# EAGLE design Durchgangsprüfer11 (EAGLE 8.3.2)
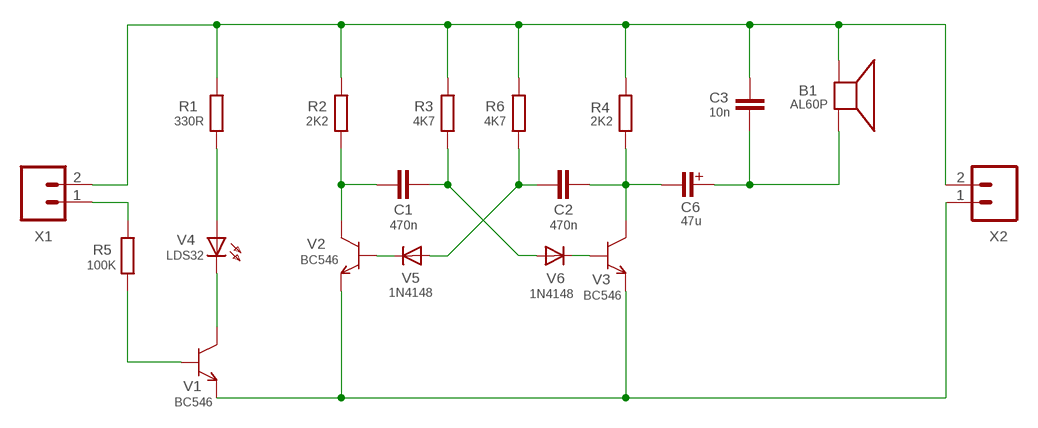
[diagram p0: schematic, sheet 1]

## Parts
B1  AL60P  [AL60P]
C1  470n  C-EUC05-024X044  [C050-024X044]
C2  470n  C-EUC05-024X044  [C050-024X044]
C3  10n  C-EUC05-024X044  [C050-024X044]
C6  47u  CPOL-EUE2.5-6  [E2,5-6]
R1  330R  R-EU_0207/10  [0207/10]
R2  2K2  R-EU_0207/10  [0207/10]
R3  4K7  R-EU_0207/10  [0207/10]
R4  2K2  R-EU_0207/10  [0207/10]
R5  100K  R-EU_0207/10  [0207/10]
R6  4K7  R-EU_0207/10  [0207/10]
V1  BC546  NPN_EBCBC546  [TO92IL]
V2  BC546  NPN_EBCBC546  [TO92IL]
V3  BC546  NPN_EBCBC546  [TO92IL]
V4  LDS32  LED5MM  [LED5]
V5  1N4148  DIODE7_5  [D7_5]
V6  1N4148  DIODE7_5  [D7_5]
X1  M02  [02P]
X2  M02  [02P]

## Nets
+12: B1.1 C3.1 R1.2 R2.2 R3.2 R4.2 R6.2 X1.2 X2.2
GND: V1.E V2.E V3.E X2.1
N$1: C2.1 R6.1 V5.A
N$2: C1.2 R3.1 V6.A
N$3: V2.B V5.C
N$4: C1.1 R2.1 V2.C
N$5: V3.B V6.C
N$6: C2.2 C6.- R4.1 V3.C
N$7: B1.2 C3.2 C6.+
N$10: R1.1 V4.A
N$11: V1.C V4.K(C)
N$12: R5.2 V1.B
N$13: R5.1 X1.1

## Library data of the parts
B1 = buzzer:AL60P: SPEAKER Source: Buerklin
C1-C3 = mylib:C-EU
C6 = mylib:CPOL-EU: POLARIZED CAPACITOR, European symbol
R1-R6 = mylib:R-EU_: RESISTOR, European symbol
V1-V3 = mylib:NPN_EBC
V4 = mylib:LED
V5 V6 = mylib:DIODE
X1 X2 = con-amp-quick:M02: AMP QUICK CONNECTOR

## Board
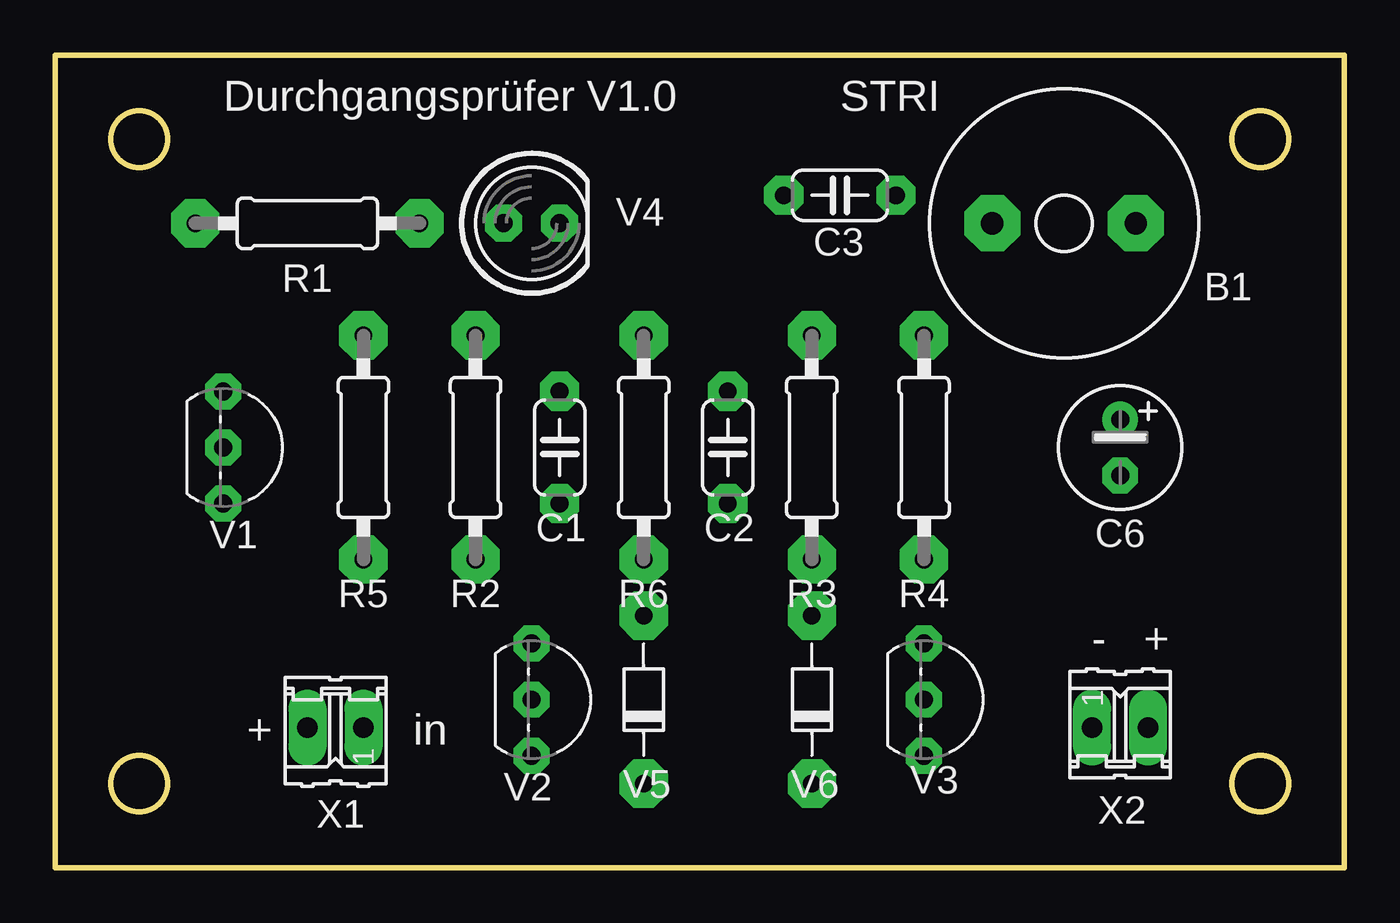
[diagram p1: board, top side]
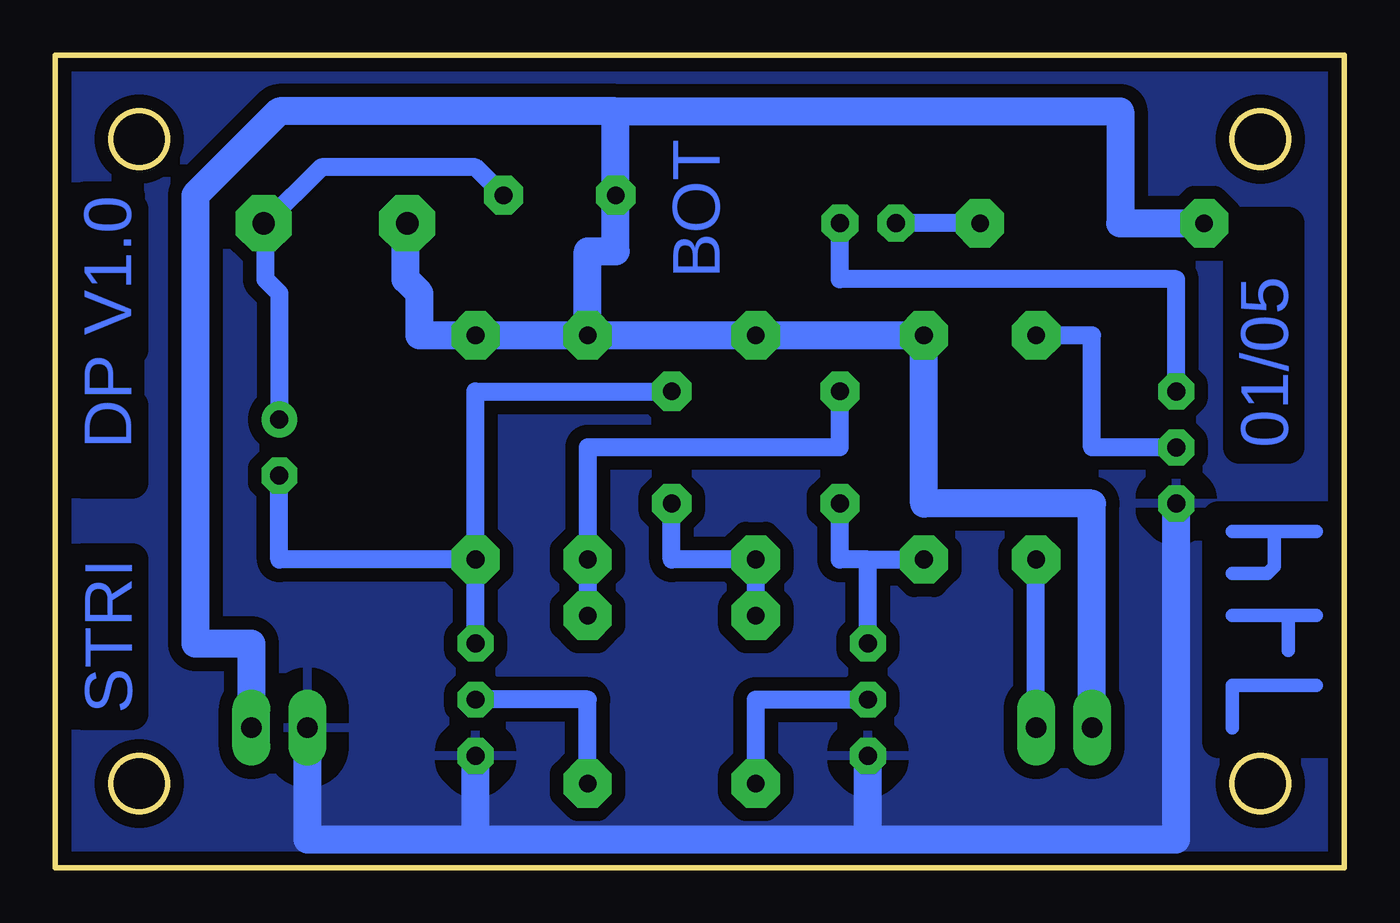
[diagram p2: board, bottom side, seen from below]

Size 58.42 x 36.83 mm. Coordinates in mm from the lower left corner, seen from the top.
Outline: 0,0 58.42,0 58.42,36.83 0,36.83 0,0
Outline: circle at 3.81,33.02 radius 1.27
Outline: circle at 54.61,33.02 radius 1.27
Outline: circle at 54.61,3.81 radius 1.27
Outline: circle at 3.81,3.81 radius 1.27
Copper layers (1+16): Top 0.035mm / dielectric 1.5mm / Bottom 0.035mm
Design rules "2HN": minimum track width 16mil, minimum drill 0.6mm, track to track 10mil, track to pad 8mil, pad to pad 8mil, via to via 8mil, smd to smd 8mil, copper to edge 20mil, drill to drill 8mil, minimum pad ring 16mil, minimum via ring 15mil, stop-mask expansion 4mil, vias tented up to drill 0mil, thermal gap 40mil
bRestrict: 20 lines

### Footprints (pad centres in the part's own frame; a part is rotated, then mirrored left to right if it is on the bottom)
AL60P = drill 1.016 pad 2.54 octagon: 1 -3.251,0; 2 3.251,0
C050-024X044 = drill 0.8 pad 1.778 octagon: 1 -2.54,0; 2 2.54,0
E2,5-6 = drill 0.813 pad 1.6: + -1.27,0 | drill 0.813 pad 1.6 octagon: - 1.27,0
0207/10 = drill 0.8 pad 2.184 octagon: 1 -5.08,0; 2 5.08,0
TO92IL = drill 0.813 octagon: B 0,0; C -2.54,0; E 2.54,0
LED5 = drill 0.813 pad 1.676 octagon: A -1.27,0; K 1.27,0
D7_5 = drill 0.8 pad 2.184 octagon: A 3.81,0; C -3.81,0
02P = drill 0.914 long: 1 -1.27,0; 2 1.27,0

### Placement (x,y rotation side)
B1  45.72,29.21 0 top
C1  22.86,19.05 90 top
C2  30.48,19.05 90 top
C3  35.56,30.48 0 top
C6  48.26,19.05 270 top
R1  11.43,29.21 180 top
R2  19.05,19.05 90 top
R3  34.29,19.05 90 top
R4  39.37,19.05 90 top
R5  13.97,19.05 90 top
R6  26.67,19.05 90 top
V1  7.62,19.05 270 top
V2  21.59,7.62 270 top
V3  39.37,7.62 270 top
V4  21.59,29.21 0 top
V5  26.67,7.62 90 top
V6  34.29,7.62 90 top
X1  12.7,6.35 180 top
X2  48.26,6.35 0 top

### Tracks (layer width: path | path; a pad name or v marks a point on that pad's centre or on a via)
+12
  Bottom 0.813: 42.55,29.21 B1.1
  Bottom 1.27: 42.55,29.21 42.55,26.67 41.91,26.04 41.91,24.13 R4.2 R3.2 | R3.2 34.29,27.94 33.02,27.94 C3.1 33.02,34.29 | R3.2 R6.2 R2.2 19.05,16.51 11.43,16.51 X1.2 | R1.2 10.16,29.21 10.16,34.29 33.02,34.29 | 33.02,34.29 48.26,34.29 52.07,30.48 52.07,10.16 49.53,10.16 X2.2
GND
  Bottom 1.27: X2.1 46.99,1.27 39.37,1.27 | 39.37,1.27 V3.E | 21.59,1.27 39.37,1.27 | 21.59,1.27 V2.E | V1.E 7.62,1.27 21.59,1.27
  pour Bottom (isolate 0.61): 0,36.83 58.42,36.83 58.42,0 0,0
N$1
  Bottom 0.813: V5.A R6.1 30.48,13.97 C2.1
N$2
  Bottom 0.813: V6.A R3.1 34.29,19.05 22.86,19.05 C1.2
N$3
  Bottom 0.813: V2.B 26.67,7.62 V5.C
N$4
  Bottom 0.813: V2.C 21.59,13.97 | 21.59,13.97 R2.1 | C1.1 22.86,13.97 21.59,13.97
N$5
  Bottom 0.813: V6.C 34.29,7.62 V3.B
N$6
  Bottom 0.813: V3.C R4.1 | C2.2 39.37,21.59 R4.1 | R4.1 48.26,13.97 C6.-
N$7
  Bottom 0.813: C3.2 39.37,31.75 46.35,31.75 48.9,29.21 | C6.+ 48.26,26.04 48.9,26.67 48.9,29.21 | 48.9,29.21 B1.2
N$10
  Bottom 0.813: R1.1 V4.A
N$11
  Bottom 0.813: V1.C 7.62,26.67 22.86,26.67 V4.K
N$12
  Bottom 0.813: V1.B 11.43,19.05 11.43,24.13 R5.2
N$13
  Bottom 0.813: X1.1 R5.1
N$17
  Bottom 0.61: 3.17,15.24 1.27,15.24 | 3.17,15.24 5.08,15.24 | 3.17,15.24 3.17,13.65 3.49,13.34 5.08,13.34
N$18
  Bottom 0.61: 2.54,11.43 1.27,11.43 | 2.54,11.43 5.08,11.43 | 2.54,9.84 2.54,11.43
N$19
  Bottom 0.61: 1.27,8.26 5.08,8.26 5.08,6.35

### Text on the board
Bottom: BOT | DP V1.0 | 01/05 | STRI
tPlace: Durchgangsprüfer V1.0 | STRI | - | + | + | in